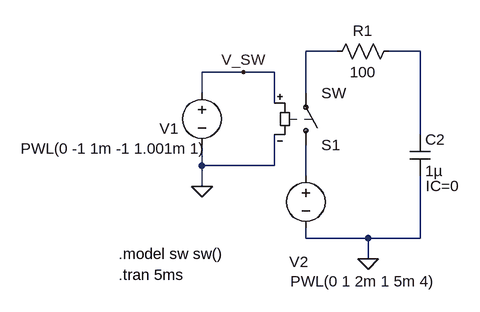
[diagram p0: schematic Switched-C.asc]
Switched-C.asc, the LTspice schematic file:
Version 4.1
SHEET 1 880 680
WIRE 16 80 -32 80
WIRE 144 80 96 80
WIRE -128 112 -192 112
WIRE -80 112 -128 112
WIRE -192 144 -192 112
WIRE -32 144 -32 80
WIRE -80 160 -80 112
WIRE 144 208 144 80
WIRE -192 256 -192 224
WIRE -80 256 -80 208
WIRE -80 256 -192 256
WIRE -32 272 -32 224
WIRE -192 288 -192 256
WIRE -32 368 -32 352
WIRE 64 368 -32 368
WIRE 144 368 144 272
WIRE 144 368 64 368
WIRE 64 400 64 368
FLAG 64 400 0
FLAG -192 288 0
FLAG -128 112 V_SW
SYMBOL cap 128 208 R0
WINDOW 39 25 79 Left 2
SYMATTR SpiceLine IC=0
SYMATTR InstName C2
SYMATTR Value 1µ
SYMBOL res 112 64 R90
WINDOW 0 0 56 VBottom 2
WINDOW 3 32 56 VTop 2
SYMATTR InstName R1
SYMATTR Value 100
SYMBOL voltage -192 128 R0
WINDOW 3 -279 102 Left 2
WINDOW 123 0 0 Left 0
WINDOW 39 0 0 Left 0
WINDOW 0 -65 71 Left 2
SYMATTR Value PWL(0 -1 1m -1 1.001m 1)
SYMATTR InstName V1
SYMBOL sw -32 240 M180
SYMATTR InstName S1
SYMBOL voltage -32 256 R0
WINDOW 3 -24 178 Left 2
WINDOW 123 0 0 Left 0
WINDOW 39 0 0 Left 0
WINDOW 0 -25 148 Left 2
SYMATTR Value PWL(0 1 2m 1 5m 4)
SYMATTR InstName V2
TEXT -320 392 Left 2 !.model sw sw()
TEXT -320 424 Left 2 !.tran 5ms

The netlist it stands for:
* Switched-C.asc
C2 N002 0 1µ IC=0
R1 N002 N001 100
V1 V_SW 0 PWL(0 -1 1m -1 1.001m 1)
S1 N003 N001 V_SW 0 SW
V2 N003 0 PWL(0 1 2m 1 5m 4)
.model sw sw()
.tran 5ms
.backanno
.end